# Altium schematic sheet IsoUSBTest.SchDoc
size A3; PageSetup: Record=PageOptions|CenterHorizontal=True|CenterVertical=True|PrintScale=0.68|XCorrection=1.00|YCorrection=1.00|PrintKind=1|BorderSize=5000000|LeftOffset=0|BottomOffset=0|Orientation=2|PaperLength=1000|PaperWidth=1000|Scale=100|PaperSource=7|PrintQuality=-4|MediaType=1|DitherType=10|PrintScaleMode=1|PaperKind=A3
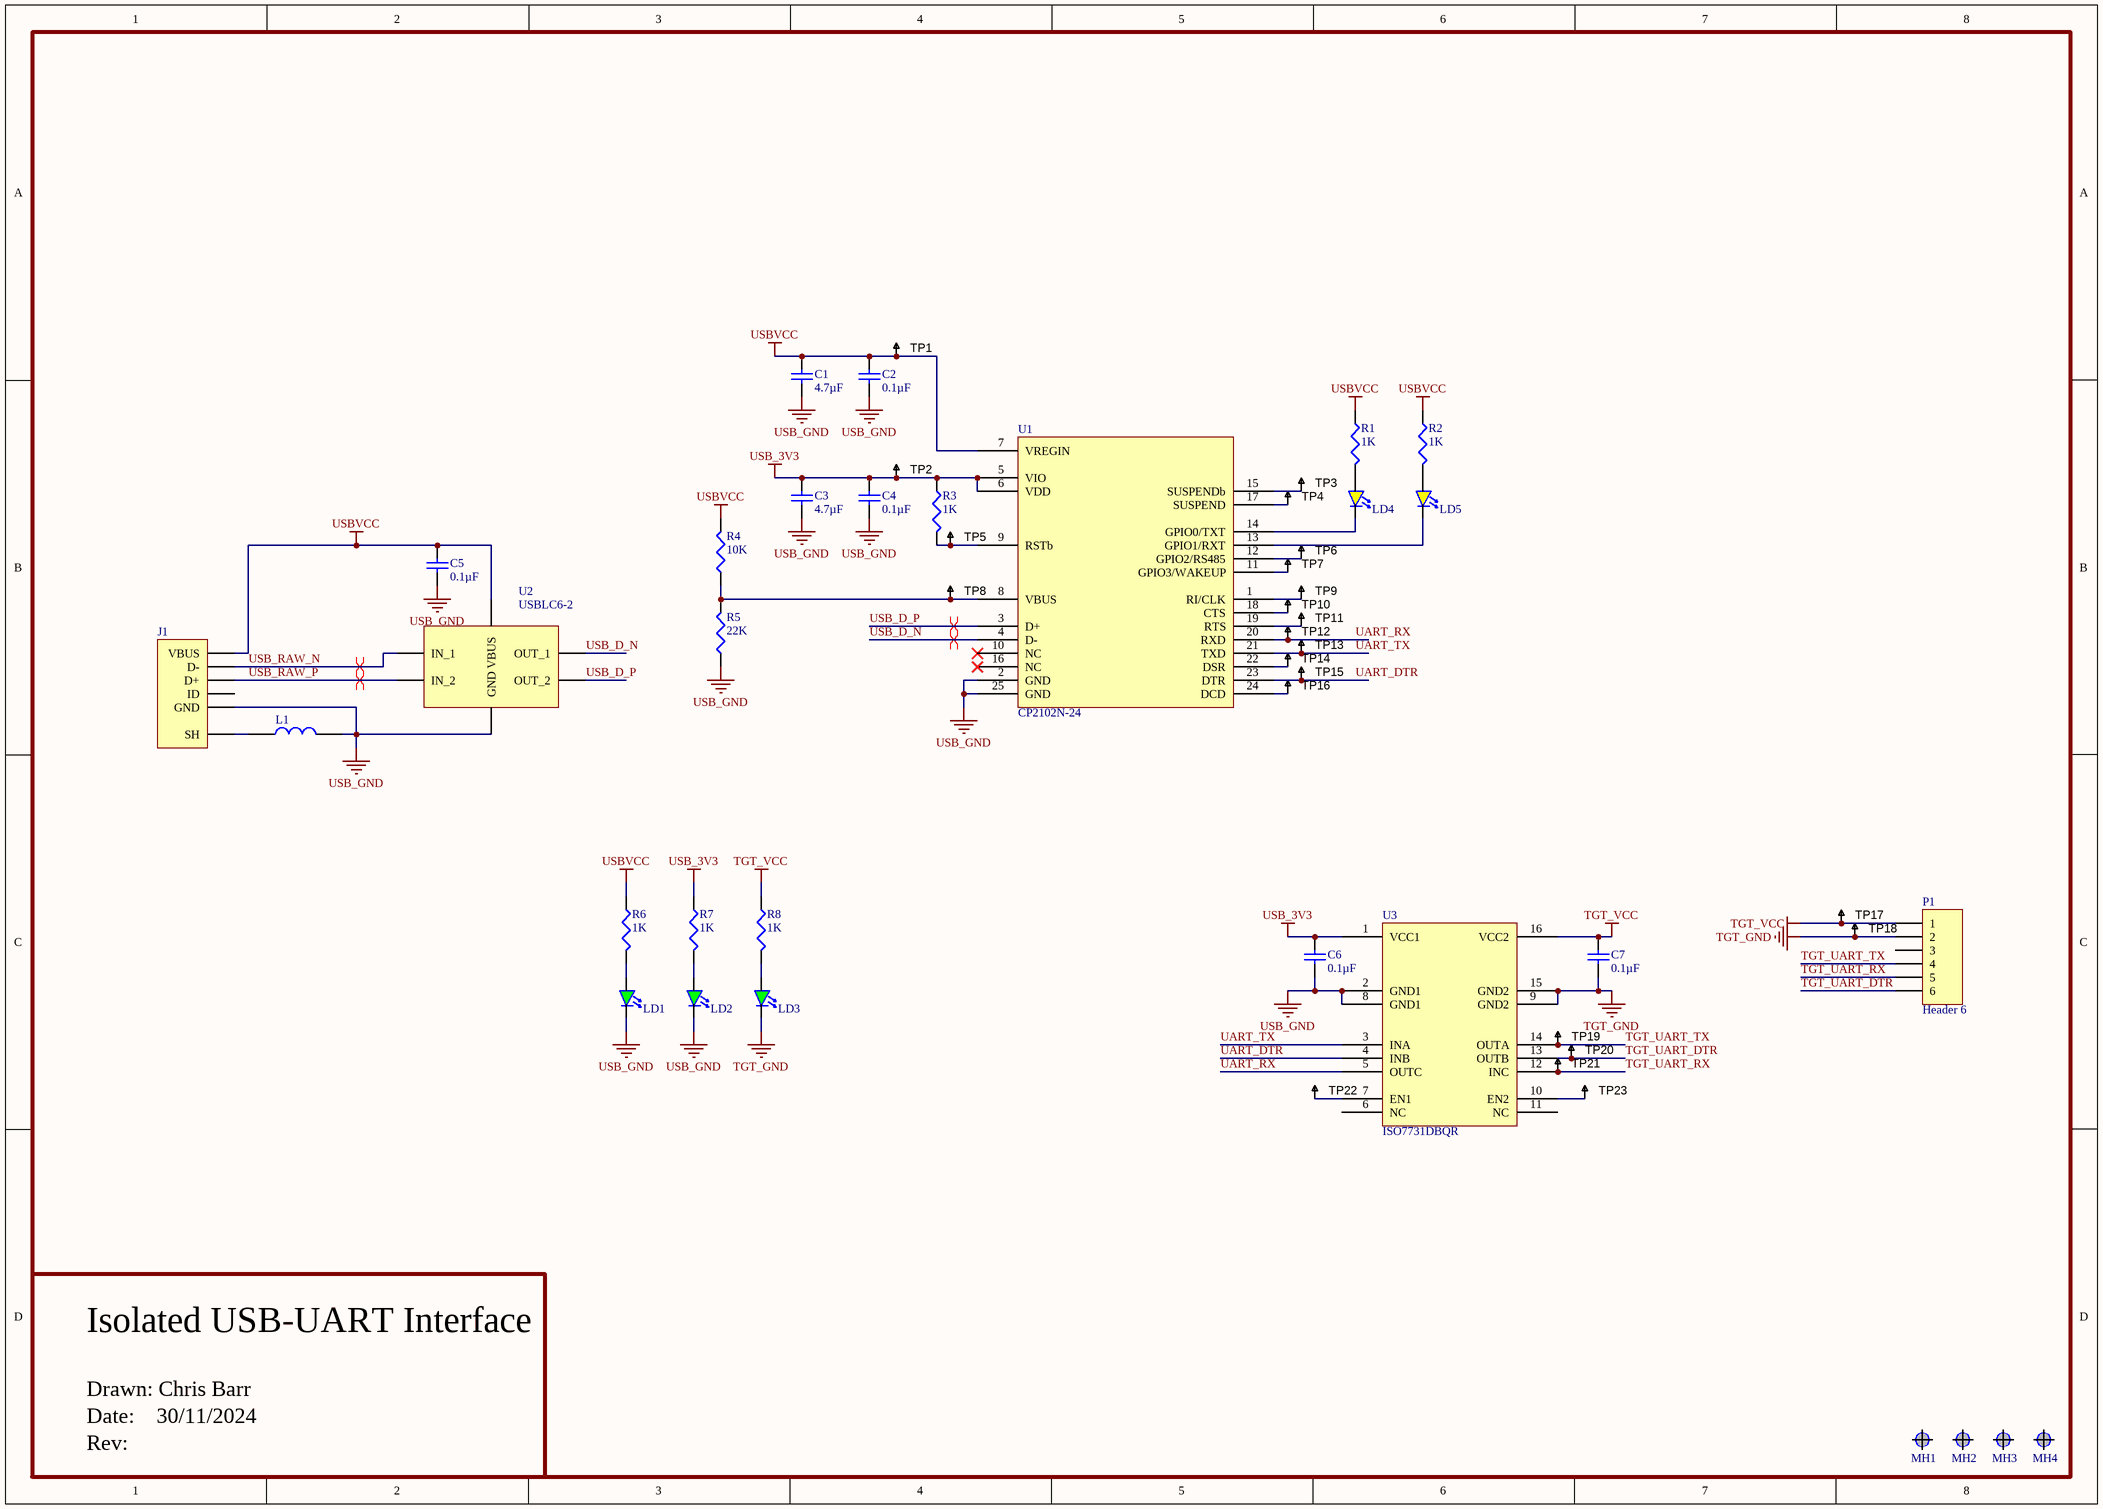
[diagram p0: IsoUSBTest.SchDoc]

## Parts
C1  value 4.7µF  [CAPC1608X90N]  (hidden comment: Capacitor)
C2  value 0.1µF  [CAPC1608X90N]  (hidden comment: Capacitor)
C3  value 4.7µF  [CAPC1608X90N]  (hidden comment: Capacitor)
C4  value 0.1µF  [CAPC1608X90N]  (hidden comment: Capacitor)
C5  value 0.1µF  [CAPC1608X90N]  (hidden comment: Capacitor)
C6  value 0.1µF  [CAPC1608X90N]  (hidden comment: Capacitor)
C7  value 0.1µF  [CAPC1608X90N]  (hidden comment: Capacitor)
J1  (no value)  [Micro-USB B Molex 105017-0001]
L1  (no value)  [Res 2012-0805]
LD1  LEDG  0603  [LED 1608-0603]  (value not drawn)
LD2  LEDG  0603  [LED 1608-0603]  (value not drawn)
LD3  LEDG  0603  [LED 1608-0603]  (value not drawn)
LD4  (no value)  [LED 1608-0603]
LD5  (no value)  [LED 1608-0603]
MH1  Screw Hole  [M3-Hole-2]  (value not drawn)  (no BOM)
MH2  Screw Hole  [M3-Hole-2]  (value not drawn)  (no BOM)
MH3  Screw Hole  [M3-Hole-2]  (value not drawn)  (no BOM)
MH4  Screw Hole  [M3-Hole-2]  (value not drawn)  (no BOM)
P1  Header 6  [HDR1X6-HEADER]
R1  value 1K  [RES 1608-0603]
R2  value 1K  [RES 1608-0603]
R3  value 1K  [RES 1608-0603]
R4  value 10K  [RES 1608-0603]
R5  value 22K  [RES 1608-0603]
R6  value 1K  [RES 1608-0603]
R7  value 1K  [RES 1608-0603]
R8  value 1K  [RES 1608-0603]
TP1  TESTPOINT  [TP-THT_TINY]  (value not drawn)  (no BOM)
TP2  TESTPOINT  [TP-THT_TINY]  (value not drawn)  (no BOM)
TP3  TESTPOINT  [TP-THT_TINY]  (value not drawn)  (no BOM)
TP4  TESTPOINT  [TP-THT_TINY]  (value not drawn)  (no BOM)
TP5  TESTPOINT  [TP-THT_TINY]  (value not drawn)  (no BOM)
TP6  TESTPOINT  [TP-THT_TINY]  (value not drawn)  (no BOM)
TP7  TESTPOINT  [TP-THT_TINY]  (value not drawn)  (no BOM)
TP8  TESTPOINT  [TP-THT_TINY]  (value not drawn)  (no BOM)
TP9  TESTPOINT  [TP-THT_TINY]  (value not drawn)  (no BOM)
TP10  TESTPOINT  [TP-THT_TINY]  (value not drawn)  (no BOM)
TP11  TESTPOINT  [TP-THT_TINY]  (value not drawn)  (no BOM)
TP12  TESTPOINT  [TP-THT_TINY]  (value not drawn)  (no BOM)
TP13  TESTPOINT  [TP-THT_TINY]  (value not drawn)  (no BOM)
TP14  TESTPOINT  [TP-THT_TINY]  (value not drawn)  (no BOM)
TP15  TESTPOINT  [TP-THT_TINY]  (value not drawn)  (no BOM)
TP16  TESTPOINT  [TP-THT_TINY]  (value not drawn)  (no BOM)
TP17  TESTPOINT  [TP-THT_TINY]  (value not drawn)  (no BOM)
TP18  TESTPOINT  [TP-THT_TINY]  (value not drawn)  (no BOM)
TP19  TESTPOINT  [TP-THT_TINY]  (value not drawn)  (no BOM)
TP20  TESTPOINT  [TP-THT_TINY]  (value not drawn)  (no BOM)
TP21  TESTPOINT  [TP-THT_TINY]  (value not drawn)  (no BOM)
TP22  TESTPOINT  [TP-THT_TINY]  (value not drawn)  (no BOM)
TP23  TESTPOINT  [TP-THT_TINY]  (value not drawn)  (no BOM)
U1  CP2102N-24  [QFN50P400X400X80_HS-25N]
U2  USBLC6-2  [SOT95P280X145-6N]
U3  ISO7731DBQR  [SOP64P600X175-16N]

## Nets
TGT_GND: C7.1 LD3.2(K) P1.2 TP18.1 U3.9(GND2) U3.15(GND2)
TGT_VCC: C7.2 P1.1 R8.1 TP17.1 U3.16(VCC2)
USB_3V3: C3.2 C4.2 C6.2 R3.1 R7.1 TP2.1 U1.5(VIO) U1.6(VDD) U3.1(VCC1)
USB_GND: C1.1 C2.1 C3.1 C4.1 C5.1 C6.1 J1.GND L1.2 LD1.2(K) LD2.2(K) R5.1 U1.2(GND) U1.25(GND) U2.2(GND) U3.2(GND1) U3.8(GND1)
USBVCC: C1.2 C2.2 C5.2 J1.VBUS R1.1 R2.1 R4.2 R6.1 TP1.1 U1.7(VREGIN) U2.5(VBUS)
TGT_UART_DTR: P1.6 TP20.1 U3.13(OUTB)
TGT_UART_RX: P1.5 TP21.1 U3.12(INC)
TGT_UART_TX: P1.4 TP19.1 U3.14(OUTA)
UART_DTR: TP15.1 U1.23(DTR) U3.4(INB)
UART_RX: TP12.1 U1.20(RXD) U3.5(OUTC)
UART_TX: TP13.1 U1.21(TXD) U3.3(INA)
USB_D_N: U1.4(D-) U2.6(OUT_1)
USB_D_P: U1.3(D+) U2.4(OUT_2)
USB_RAW_N: J1.D- U2.1(IN_1)
USB_RAW_P: J1.D+ U2.3(IN_2)
NetJ1_SHIELD: J1.SHIELD(SH) L1.1
NetLD1_1: LD1.1(A) R6.2
NetLD2_1: LD2.1(A) R7.2
NetLD3_1: LD3.1(A) R8.2
NetLD4_1: LD4.1(A) R1.2
NetLD4_2: LD4.2(K) U1.14(GPIO0/TXT)
NetLD5_1: LD5.1(A) R2.2
NetLD5_2: LD5.2(K) U1.13(GPIO1/RXT)
NetR3_2: R3.2 TP5.1 U1.9(RSTb)
NetR4_1: R4.1 R5.2 TP8.1 U1.8(VBUS)
NetTP3_1: TP3.1 U1.15(SUSPENDb)
NetTP4_1: TP4.1 U1.17(SUSPEND)
NetTP6_1: TP6.1 U1.12(GPIO2/RS485)
NetTP7_1: TP7.1 U1.11(GPIO3/WAKEUP)
NetTP9_1: TP9.1 U1.1(RI/CLK)
NetTP10_1: TP10.1 U1.18(CTS)
NetTP11_1: TP11.1 U1.19(RTS)
NetTP14_1: TP14.1 U1.22(DSR)
NetTP16_1: TP16.1 U1.24(DCD)
NetTP22_1: TP22.1 U3.7(EN1)
NetTP23_1: TP23.1 U3.10(EN2)

Not connected (* = marked no-connect by the designer): J1 ID; MH1 M3(0); MH2 M3(0); MH3 M3(0); MH4 M3(0); P1 3; U1 10(NC)* 16(NC)*; U3 6(NC) 11(NC)

## Layout directives
differential pair: USB_D_N, USB_D_P, USB_RAW_N, USB_RAW_P

## Notes on the sheet
- Isolated USB-UART Interface
- Drawn: Chris Barr
- Date:    30/11/2024
- Rev:
- Title
- Size:
- Date:
- File:
- A1
- Number:
- Time:
- Revision:
- Sheet
- of

## Library data of the parts
C1 C3 = EMK107ABJ475KA-T: CAP CER 4.7UF 16V X5R 0603; Manufacturer 1: Taiyo Yuden; Note: Approved sub OK; Tolerance: ±10%; Revision: July-2002: Re-released for DXP Platform.; Voltage: 16V; Supplier 1: Digi-Key; Supplier Part Number 1: 587-2786-1-ND; Package: 0402; Type: X5R; Manufacturer Part Number 1: EMK107ABJ475KA-T; Temperature Coefficient: X5R; Operating Temperature: -55°C ~ 85°C; Package / Case: 0603 (1608 Metric); Size / Dimension: 0.063" L x 0.031" W (1.60mm x 0.80mm); Thickness (Max): 0.035" (0.90mm)
C2 C4-C7 = EMK107B7104KAHT: CAP CER 0.1UF 16V X7R 0603; Manufacturer 1: Taiyo Yuden; Note: Approved sub OK; Tolerance: ±10%; Type: X5R; Revision: July-2002: Re-released for DXP Platform.; Voltage: 16V; Supplier 1: Digi-Key; Supplier Part Number 1: 587-6004-1-ND; Package: 0402; Manufacturer Part Number 1: EMK107B7104KAHT; Temperature Coefficient: X7R; Operating Temperature: -55°C ~ 125°C; Package / Case: 0603 (1608 Metric); Size / Dimension: 0.063" L x 0.031" W (1.60mm x 0.80mm); Thickness (Max): 0.035" (0.90mm)
J1 = Micro-USB B Socket: CONN RCPT USB2.0 MICRO B SMD R/A; Note: Approved sub OK; Supplier 1: Digi-Key; Supplier Part Number 1: WM1399CT-ND
L1 = Ferrite Bead SMD 0805: FERRITE BEAD 220 OHM 0805 1LN; Note: Approved sub OK; Revision: July-2002: Re-released for DXP Platform.; Supplier 1: Digi-Key; Supplier Part Number 1: 490-1054-1-ND
LD1-LD3 = LEDG  0603: LED GREEN CLEAR CHIP SMD 0603; Note: Approved sub OK; Supplier 1: Digi-Key; Supplier Part Number 1: 160-1435-2-ND
LD4 LD5 = LEDY  0603: LED YELLOW CLEAR CHIP SMD 0603; Note: Approved sub OK; Supplier 1: Digi-Key; Supplier Part Number 1: 160-1437-1-ND
P1 = Header 1X6: Header, 6-Pin; Manufacturer 1: Generic Header; Note: Approved sub OK
R1-R3 R6-R8 = Res-0603-1K: RES SMD 1K OHM 1% 1/10W 0603; Note: Approved sub OK; Published: 8-Jun-2000; Revision: July-2002: Re-released for DXP Platform.; Publisher: Altium Limited; Supplier 1: Digi-Key; Supplier Part Number 1: 311-1.00KHRCT-ND
R4 = Res-0603-10K: RES SMD 10K OHM 1% 1/10W 0603; Note: Approved sub OK; Published: 8-Jun-2000; Revision: July-2002: Re-released for DXP Platform.; Publisher: Altium Limited; Supplier 1: Digi-Key; Supplier Part Number 1: 311-10.0KHRCT-ND
R5 = Res-0603-10K: RES SMD 22K OHM 1% 1/10W 0603; Note: Approved sub OK; Published: 8-Jun-2000; Revision: July-2002: Re-released for DXP Platform.; Publisher: Altium Limited; Supplier 1: Digi-Key; Supplier Part Number 1: 311-10.0KHRCT-ND
TP1-TP23 = TESTPOINT: SMD test pin
U1 = IC - CP2102N-24: Supplier 1: Digikey; Supplier Part Number 1: 336-5887-ND
U2 = USBLC6-2 USB ESD Protection: ESD Protection IC; Supplier 1: Digi-Key; Supplier Part Number 1: 497-5235-1-ND
U3 = IC - TI ISO7731 Digital Isolator: DGTL ISO 3000VRMS 3CH GP 16SSOP; Supplier 1: Digikey; Supplier Part Number 1: 296-49656-1-ND